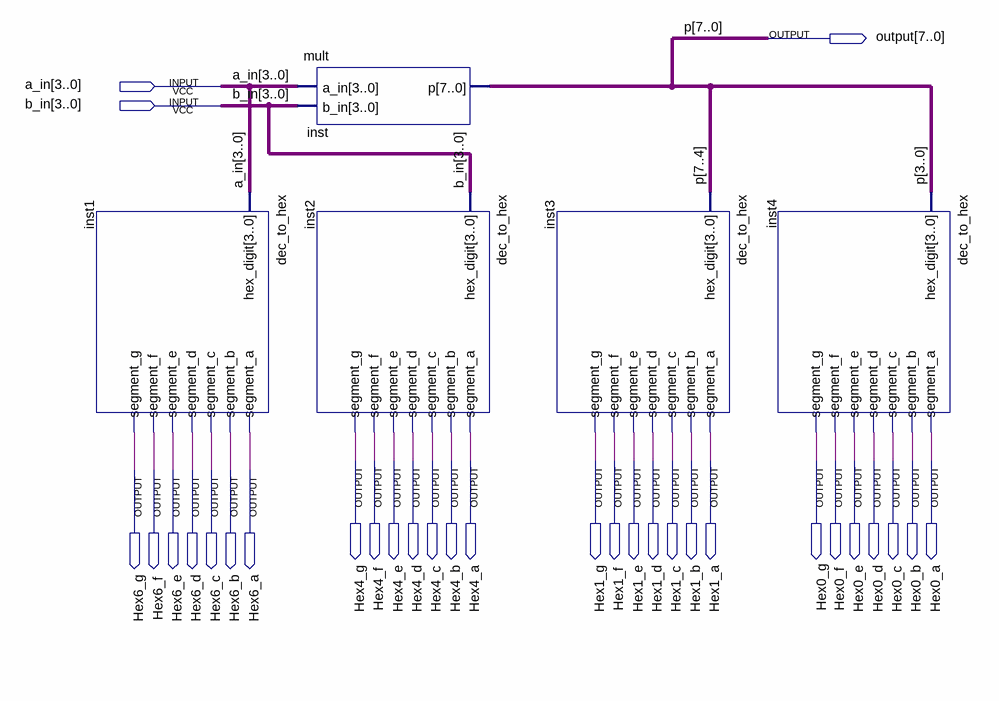
[diagram p0: schematic sheet]
// Quartus schematic multiplier.bdf as structural Verilog: 5 symbols, 31 pins
module multiplier (
  input  [3:0] a_in,
  input  [3:0] b_in,
  output [7:0] \output ,
  output Hex4_g,
  output Hex4_f,
  output Hex4_e,
  output Hex4_d,
  output Hex4_c,
  output Hex4_b,
  output Hex4_a,
  output Hex1_g,
  output Hex1_f,
  output Hex1_e,
  output Hex1_d,
  output Hex1_c,
  output Hex1_b,
  output Hex1_a,
  output Hex0_g,
  output Hex0_f,
  output Hex0_e,
  output Hex0_d,
  output Hex0_c,
  output Hex0_b,
  output Hex0_a,
  output Hex6_g,
  output Hex6_f,
  output Hex6_e,
  output Hex6_d,
  output Hex6_c,
  output Hex6_b,
  output Hex6_a
);

  dec_to_hex inst1 (
    .hex_digit(a_in), .segment_a(Hex6_a), .segment_b(Hex6_b), .segment_c(Hex6_c), .segment_d(Hex6_d),
    .segment_e(Hex6_e), .segment_f(Hex6_f), .segment_g(Hex6_g));
  mult inst (.a_in(a_in), .b_in(b_in), .p(\output ));
  dec_to_hex inst2 (
    .hex_digit(b_in), .segment_a(Hex4_a), .segment_b(Hex4_b), .segment_c(Hex4_c), .segment_d(Hex4_d),
    .segment_e(Hex4_e), .segment_f(Hex4_f), .segment_g(Hex4_g));
  dec_to_hex inst3 (
    .hex_digit(\output [7:4]), .segment_a(Hex1_a), .segment_b(Hex1_b), .segment_c(Hex1_c),
    .segment_d(Hex1_d), .segment_e(Hex1_e), .segment_f(Hex1_f), .segment_g(Hex1_g));
  dec_to_hex inst4 (
    .hex_digit(\output [3:0]), .segment_a(Hex0_a), .segment_b(Hex0_b), .segment_c(Hex0_c),
    .segment_d(Hex0_d), .segment_e(Hex0_e), .segment_f(Hex0_f), .segment_g(Hex0_g));

  // Other names for the same wires on the sheet: p[7:0] = \output 
endmodule
